# EAGLE design Esquema (EAGLE 9.6.2)
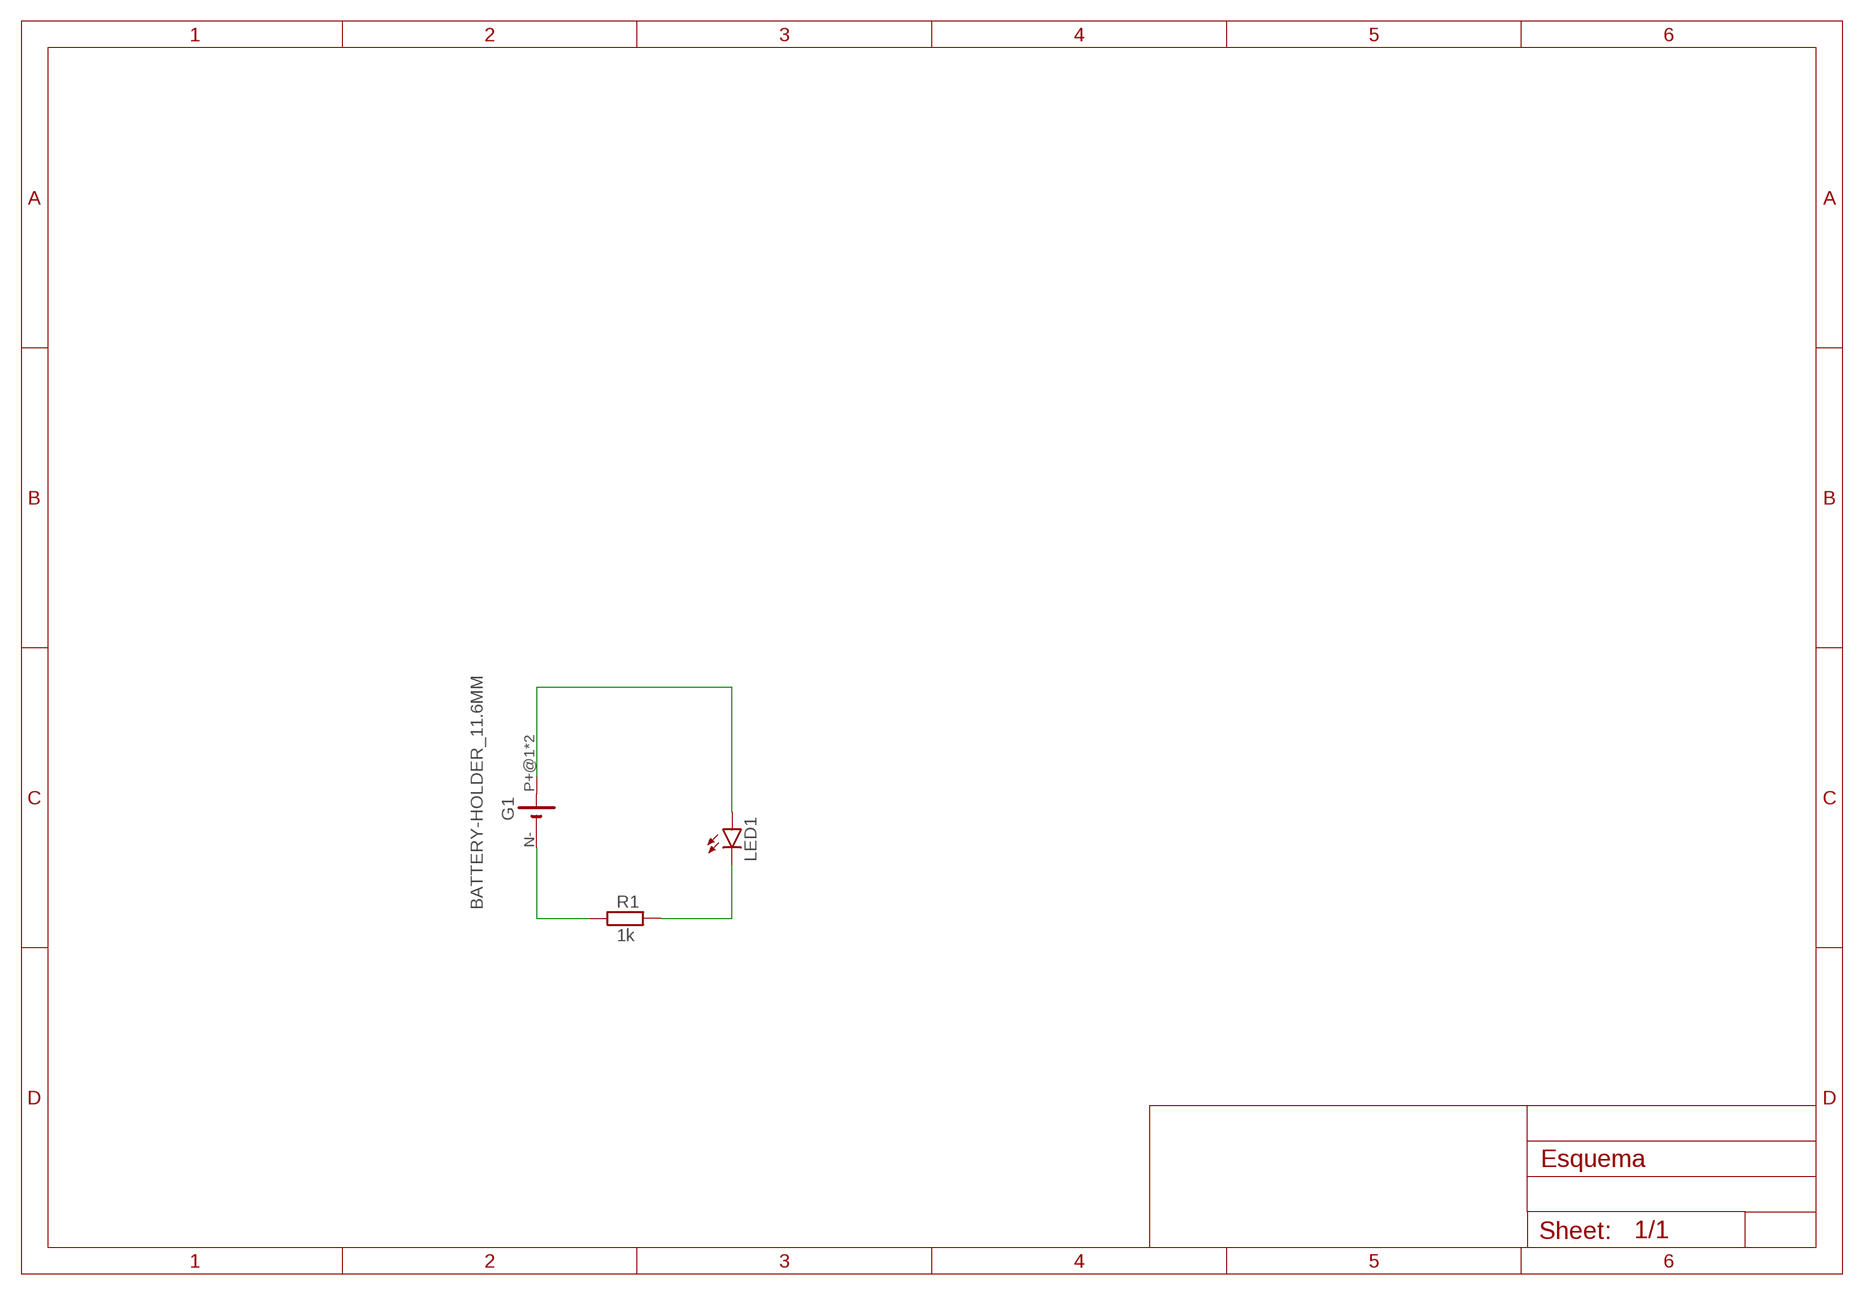
[diagram p0: schematic, sheet 1]

## Parts
G1  BATTERY-HOLDER_11.6MM  [CELL_RETAINER_11.6MM]
LED1  LED5MM  [LED5MM]
R1  1k  R-EU_0207/10  [0207/10]

## Nets
N$1: G1.N-(-) R1.1
N$2: LED1.K(C) R1.2
N$3: G1.P+@1(+) G1.P+@2(+) LED1.A

## Library data of the parts
G1 = battery:BATTERY-HOLDER_11.6MM: 11.6mm PC BUTTON CELL RETAINER, high 5.97mm KEYSTONE ELECTRONICS CORP. Data sheet <http://www.farnell.com/cad/1718310.pdf>; MF: KEYSTONE; MPN: 2997; OC_FARNELL: 2293265
LED1 = led:LED: LED OSRAM: - CHIPLED LG R971, LG N971, LY N971, LG Q971, LY Q971, LO R971, LY R971 LH N974, LH R974 LS Q976, LO Q976, LY Q976 LO Q996 - Hyper CHIPLED LW Q18S LB Q993, LB Q99A, LB R99A - SideLED LS A670, LO A670, LY A670, LG A670, LP A670 LB A673, LV A673, LT A673, LW A673 LH A674 LY A675 LS A676, LA A676, LO A676, LY A676, LW A676 LS A679, LY A679, LG A679 - Hyper Micro SIDELED® LS Y876, LA Y876, LO Y876, LY Y876 LT Y87S - SmartLED LW L88C, LW L88S LB L89C, LB L89S, LG L890 LS L89K, LO L89K, LY L89K LS L896, LA L896, LO L896, LY L896 - TOPLED LS T670, LO T670, LY T670, LG T670, LP T670 LSG T670, LSP T670, LSY T670, LOP T670, LYG T670 LG T671, LOG T671, LSG T671 LB T673, LV T673, LT T673, LW T673 LH T674 LS T676, LA T676, LO T676, LY T676, LB T676, LH T676, LSB T676, LW T676 LB T67C, LV T67C, LT T67C, LS T67K, LO T67K, LY T67K, LW E67C LS E67B, LA E67B, LO E67B, LY E67B, LB E67C, LV E67C, LT E67C LW T67C LS T679, LY T679, LG T679 LS T770, LO T770, LY T770, LG T770, LP T770 LB T773, LV T773, LT T773, LW T773 LH T774 LS E675, LA E675, LY E675, LS T675 LS T776, LA T776, LO T776, LY T776, LB T776 LHGB T686 LT T68C, LB T68C - Hyper Mini TOPLED® LB M676 - Mini TOPLED Santana® LG M470 LS M47K, LO M47K, LY M47K Source: http://www.osram.convergy.de LUXEON: - LUMILED® LXK2-PW12-R00, LXK2-PW12-S00, LXK2-PW14-U00, LXK2-PW14-V00 LXK2-PM12-R00, LXK2-PM12-S00, LXK2-PM14-U00 LXK2-PE12-Q00, LXK2-PE12-R00, LXK2-PE12-S00, LXK2-PE14-T00, LXK2-PE14-U00 LXK2-PB12-K00, LXK2-PB12-L00, LXK2-PB12-M00, LXK2-PB14-N00, LXK2-PB14-P00, LXK2-PB14-Q00 LXK2-PR12-L00, LXK2-PR12-M00, LXK2-PR14-Q00, LXK2-PR14-R00 LXK2-PD12-Q00, LXK2-PD12-R00, LXK2-PD12-S00 LXK2-PH12-R00, LXK2-PH12-S00 LXK2-PL12-P00, LXK2-PL12-Q00, LXK2-PL12-R00 Source: www.luxeon.com KINGBRIGHT: KA-3528ASYC Source: www.kingbright.com
R1 = rcl:R-EU_: RESISTOR, European symbol; SPICEPREFIX: R

## Board
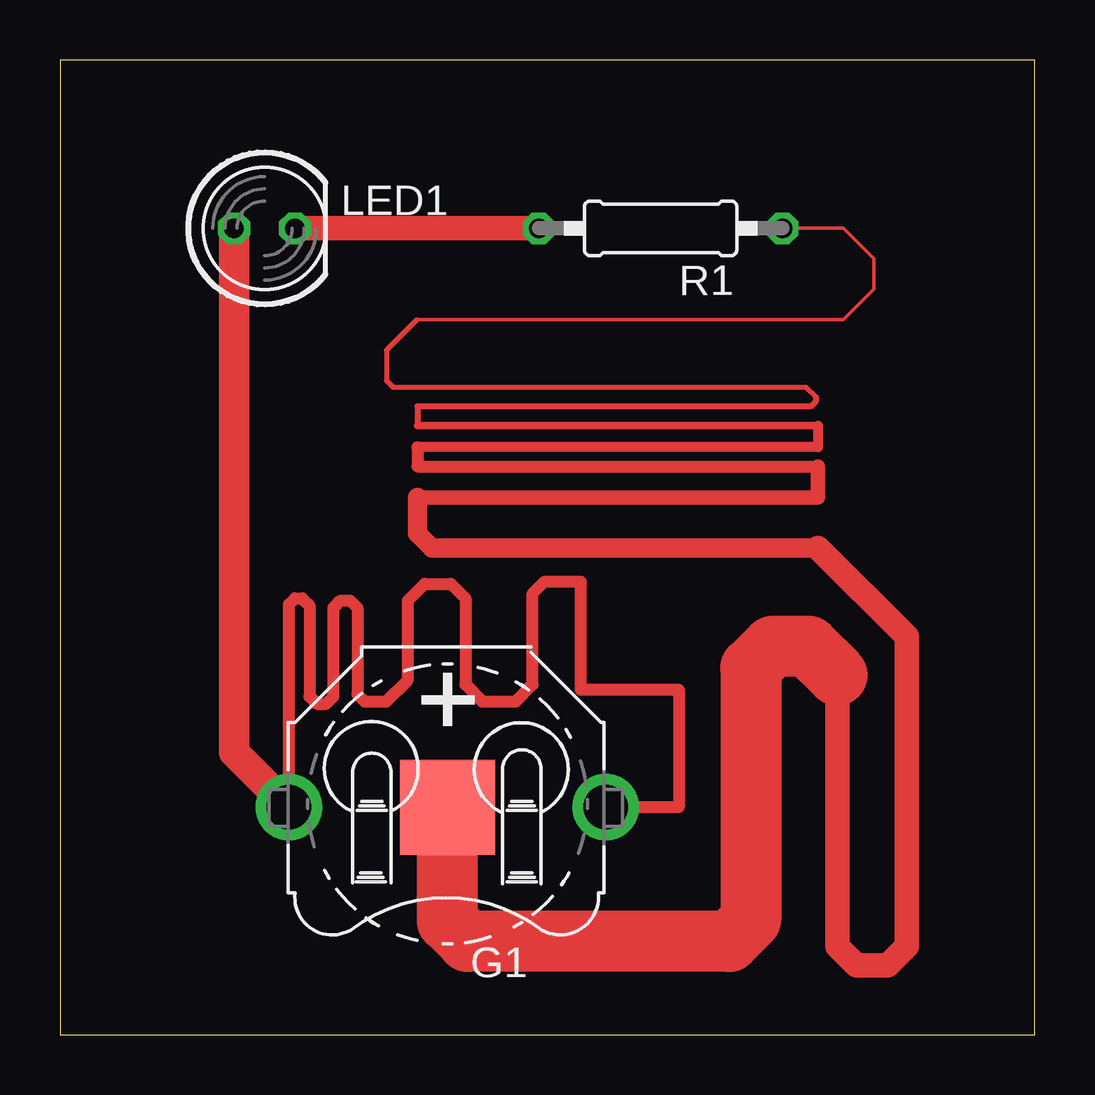
[diagram p1: board, top side]

Size 40.64 x 40.64 mm. Coordinates in mm from the lower left corner, seen from the top.
Outline: 0,0 40.64,0 40.64,40.64 0,40.64 0,0
Copper layers (1*16): Top 0.035mm / dielectric 1.5mm / Bottom 0.035mm
Design rules "default": minimum track width 6mil, minimum drill 0.35mm, track to track 6mil, track to pad 6mil, pad to pad 6mil, via to via 6mil, smd to smd 6mil, copper to edge 40mil, drill to drill 6mil, minimum pad ring 10mil, minimum via ring 8mil, stop-mask expansion 4mil, vias tented up to drill 0mil, thermal gap 10mil

### Footprints (pad centres in the part's own frame; a part is rotated, then mirrored left to right if it is on the bottom)
CELL_RETAINER_11.6MM = smd 3.96 x 3.96: N- 0,0 | drill 1.85 pad 2.54: P+@1 -6.605,0; P+@2 6.605,0
LED5MM = drill 0.813 octagon: A -1.27,0; K 1.27,0
0207/10 = drill 0.813 octagon: 1 -5.08,0; 2 5.08,0

### Placement (x,y rotation side)
G1  16.15,9.49 180 top
LED1  8.53,33.62 0 top
R1  25.04,33.62 180 top

### Tracks (layer width: path | path; a pad name or v marks a point on that pad's centre or on a via)
N$1
  Top 0.152: R1.1 32.66,33.62 33.93,32.35 33.93,31.08 32.66,29.81 14.88,29.81 | 16.15,4.75 16.1,4.8
  Top 0.2: 14.88,29.81 13.61,28.54 13.61,27.27 13.88,27 31.1,27 31.5,26.6
  Top 0.254: 31.5,26.6 31.5,26.4 31.3,26.2 14.9,26.2 14.9,25.4
  Top 0.305: 14.9,25.4 31.6,25.4
  Top 0.406: 31.6,25.4 31.6,24.5 14.9,24.5
  Top 0.508: 14.9,24.5 14.9,23.7 31.6,23.7
  Top 0.61: 31.6,23.7 31.6,22.4 14.9,22.4
  Top 0.813: 14.9,22.4 14.9,20.9 15.5,20.3 31.6,20.3
  Top 1.016: 31.6,20.3 35.3,16.6 35.3,3.7 34.5,2.9 33.2,2.9 32.4,3.7 32.4,15
  Top 2.54: 32.4,15 31.2,16.2 29.7,16.2 28.8,15.3 28.8,4.8 27.9,3.9 17,3.9 16.15,4.75 G1.N-
N$2
  Top 1.016: LED1.K R1.2
N$3
  Top 0.152: 25.8,9.5 25.79,9.49
  Top 0.508: G1.P+@2 9.54,17.95 9.8,18.2 10.1,18.2 10.4,17.9 10.4,14.1 10.7,13.8 11.1,13.8 11.4,14.1 11.4,17.8 11.7,18.1 12.1,18.1 12.4,17.8 12.4,14.2 12.7,13.9 13.6,13.9 14.5,14.8 14.5,18.1 15.2,18.8 16.3,18.8 16.9,18.2 16.9,14.6 17.6,13.9 19,13.9 19.7,14.6 19.7,18.4 20.2,18.9 21.7,18.9 21.7,14.4 25.8,14.4 25.8,9.5 | 25.79,9.49 G1.P+@1
  Top 1.27: LED1.A 7.26,11.78 G1.P+@2